# EAGLE design dual power supply (EAGLE 9.6.2)
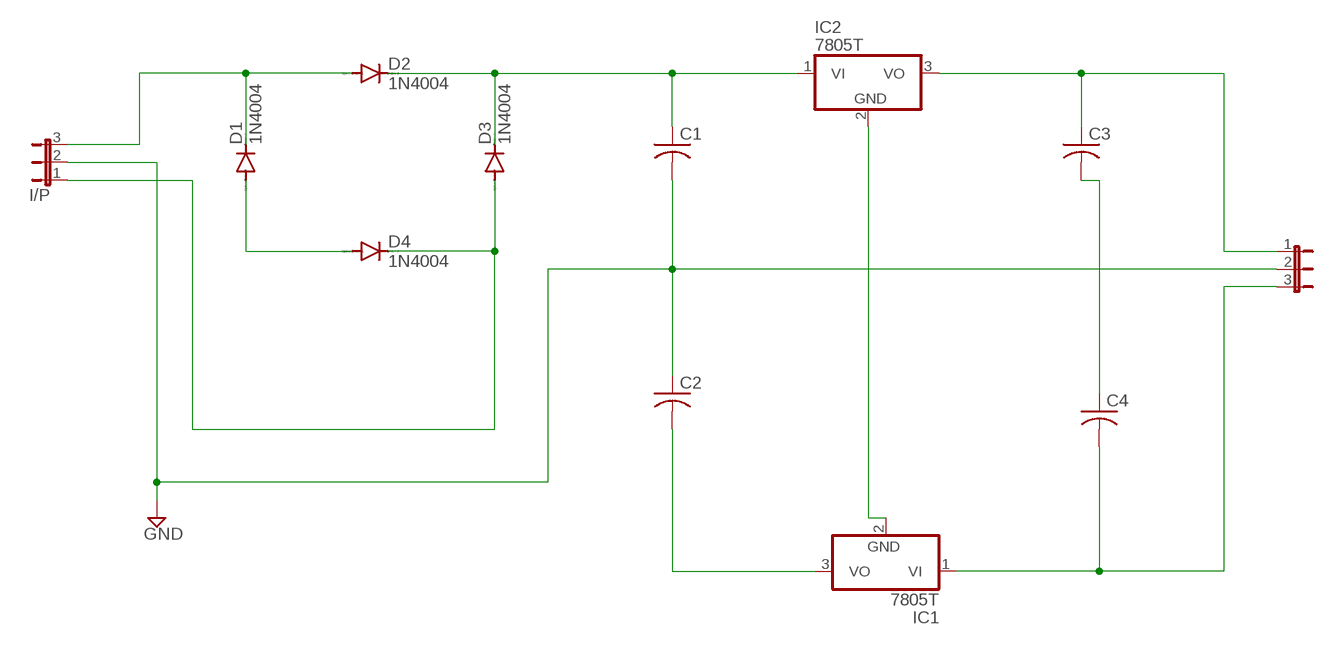
[diagram p0: schematic, sheet 1]

## Parts
C1  C-US025-024X044  [C025-024X044]
C2  C-US025-024X044  [C025-024X044]
C3  C-US025-024X044  [C025-024X044]
C4  C-US025-024X044  [C025-024X044]
D1  1N4004  [DO41-10]
D2  1N4004  [DO41-10]
D3  1N4004  [DO41-10]
D4  1N4004  [DO41-10]
I/P  JP2E  [JP2]
IC1  7805T  [TO220H]
IC2  7805T  [TO220H]
O/P  JP2E  [JP2]

## Nets
GND: C1.2 C2.1 I/P.2 O/P.2
N$1: D1.C D2.A I/P.3
N$2: D1.A D4.A
N$3: C1.1 D2.C D3.C IC2.1(VI)
N$4: D3.A D4.C I/P.1
N$5: IC1.2(GND) IC2.2(GND)
N$6: C4.2 IC1.1(VI) O/P.3
N$8: C2.2 IC1.3(VO)
N$9: C3.1 IC2.3(VO) O/P.1
N$10: C3.2 C4.1

## Library data of the parts
C1-C4 = rcl:C-US: CAPACITOR, American symbol; SPICEPREFIX: C
D1-D4 = diode:1N4004: DIODE general purpose rectifier, 1 A
I/P O/P = jumper:JP2E: JUMPER
IC1 IC2 = linear:78*: Positive VOLTAGE REGULATOR Source: http://cache.national.com/ds/LM/LM78L05.pdf http://www.fairchildsemi.com/ds/LM/LM7805.pdf

## Board
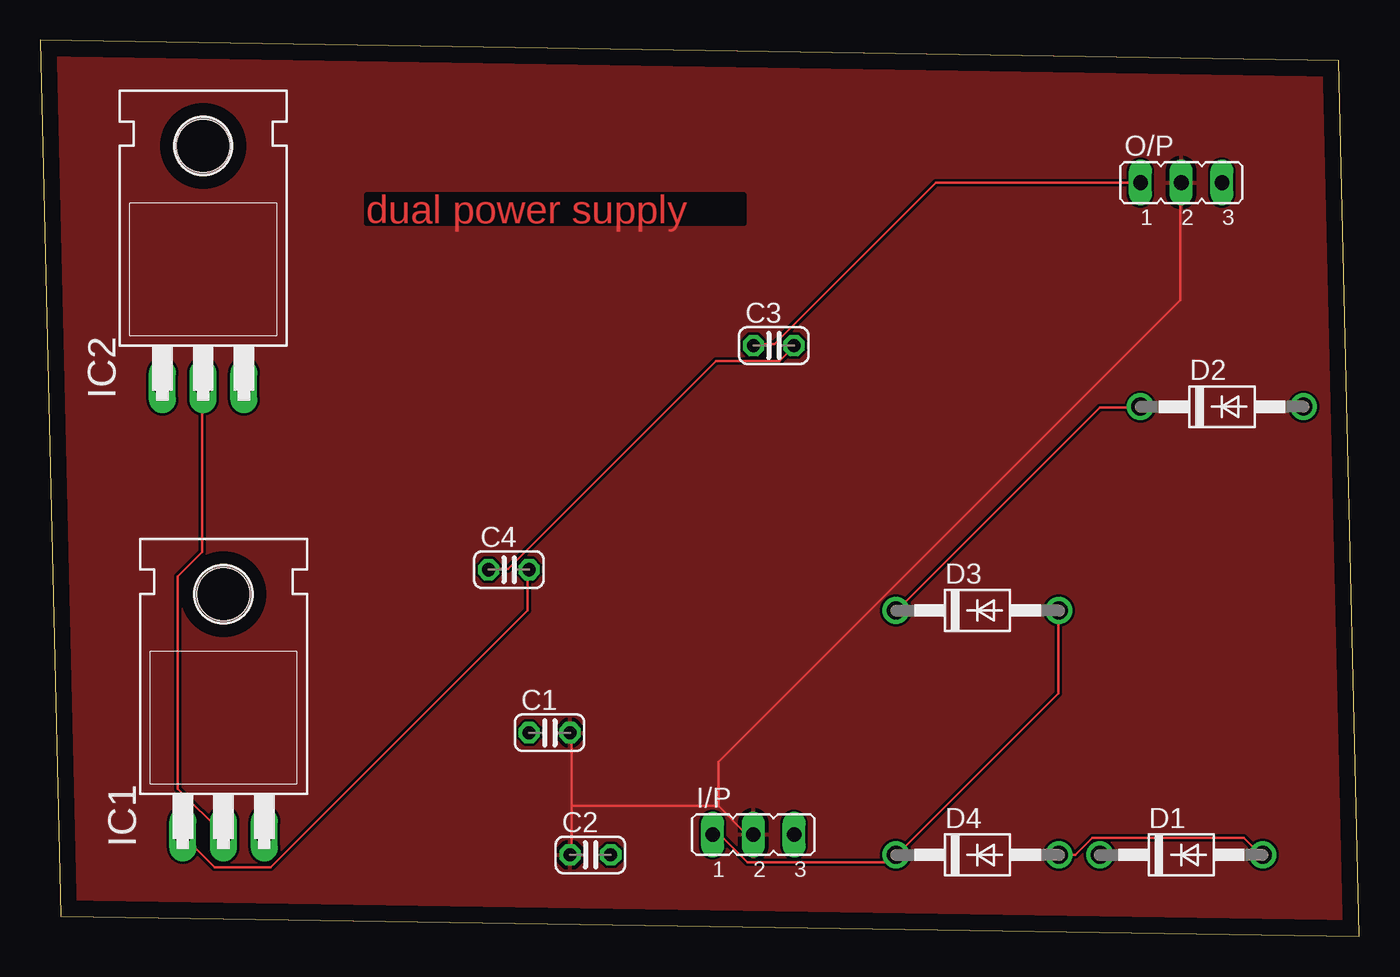
[diagram p1: board, top side]
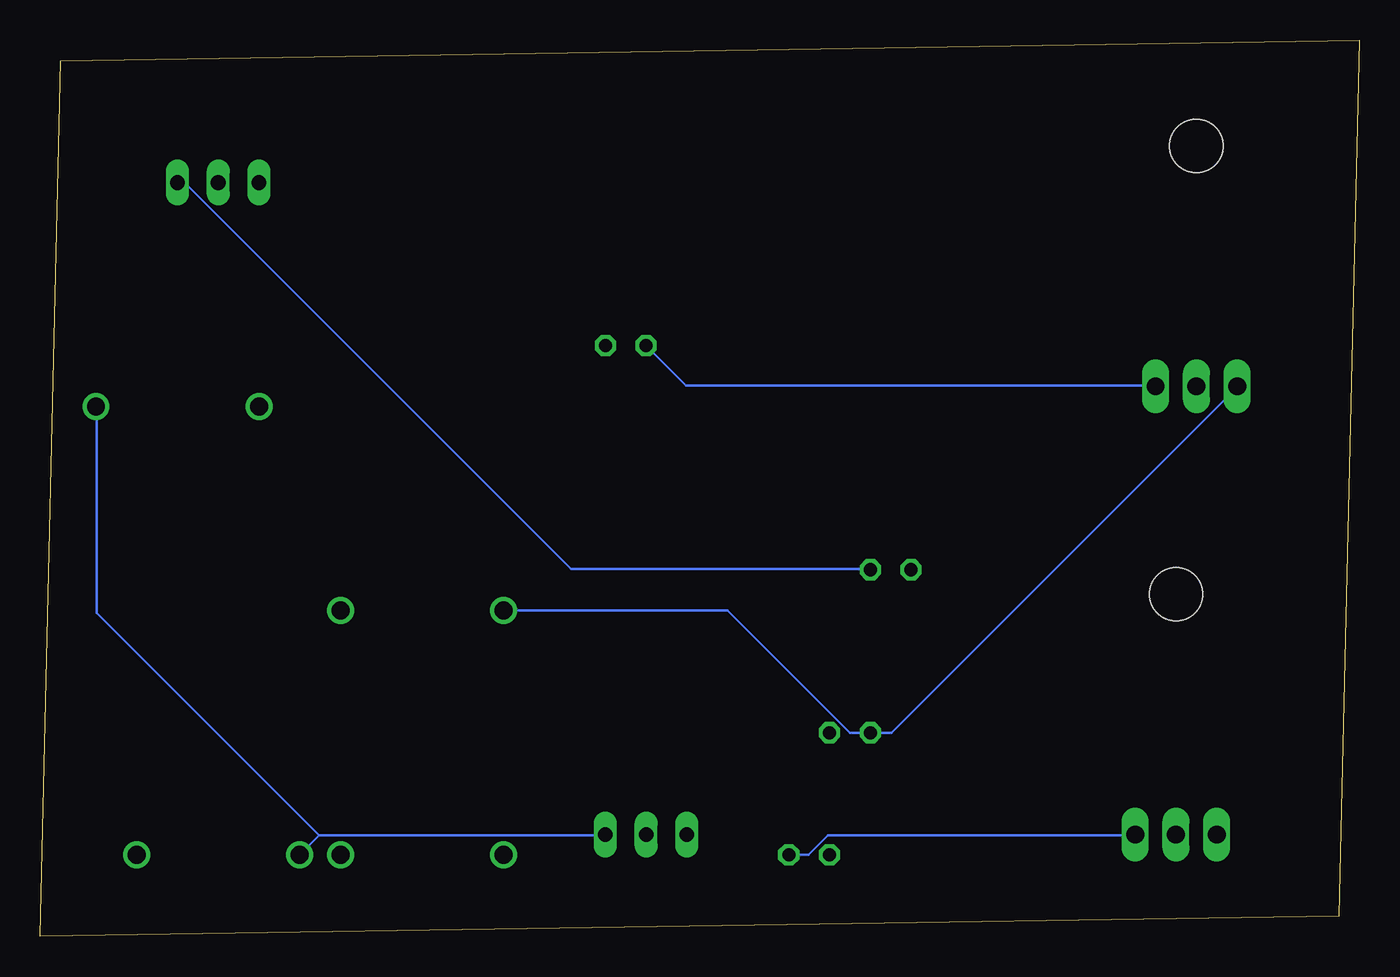
[diagram p2: board, bottom side, seen from below]

Size 82.22 x 55.87 mm. Coordinates in mm from the lower left corner, seen from the top.
Outline: 1.27,1.27 82.22,0 80.95,54.6 0,55.87 1.27,1.27
Copper layers (1*16): Top 0.035mm / dielectric 1.5mm / Bottom 0.035mm
Design rules "default": minimum track width 6mil, minimum drill 0.35mm, track to track 6mil, track to pad 6mil, pad to pad 6mil, via to via 6mil, smd to smd 6mil, copper to edge 40mil, drill to drill 6mil, minimum pad ring 10mil, minimum via ring 8mil, stop-mask expansion 4mil, vias tented up to drill 0mil, thermal gap 10mil

### Footprints (pad centres in the part's own frame; a part is rotated, then mirrored left to right if it is on the bottom)
C025-024X044 = drill 0.813 octagon: 1 -1.27,0; 2 1.27,0
DO41-10 = drill 1.118: A 5.08,0; C -5.08,0
JP2 = drill 0.914 long: 1 -2.54,0; 2 0,0; 3 2.54,0
TO220H = drill 1.118 long: 1 -2.54,-10.16; 2 0,-10.16; 3 2.54,-10.16 | hole 3.302: 0,4.826

### Placement (x,y rotation side)
C1  31.75,12.7 0 top
C2  34.29,5.08 0 top
C3  45.72,36.83 0 top
C4  29.21,22.86 0 top
D1  71.12,5.08 0 top
D2  73.66,33.02 0 top
D3  58.42,20.32 0 top
D4  58.42,5.08 0 top
I/P  44.45,6.35 0 top
IC1  11.43,16.51 0 top
IC2  10.16,44.45 0 top
O/P  71.12,46.99 0 top

### Tracks (layer width: path | path; a pad name or v marks a point on that pad's centre or on a via)
GND
  Top 0.152: 33.12,8.13 33.12,12.7 C1.2 | 33.12,8.13 33.12,5.08 C2.1 | 42.27,8.13 43.94,6.45 44.4,6.45 I/P.2 | 33.12,8.13 42.27,8.13 | 42.27,8.13 42.27,10.87 71.07,39.67 71.07,46.99 O/P.2
  pour Top: -5.08,59.69 86.36,59.69 87.63,58.42 87.63,-2.54 -2.54,-2.54 -5.08,0
N$1
  Bottom 0.152: 64.82,6.3 46.99,6.3 I/P.3 | D1.C 64.82,6.3 | 64.82,6.3 78.69,20.17 78.69,32.97 D2.A
N$2
  Top 0.152: D4.A 64.52,5.08 65.58,6.15 75.03,6.15 76.1,5.08 D1.A
N$3
  Top 0.152: D2.C 68.48,32.97 66.04,32.97 53.39,20.32 D3.C
  Bottom 0.152: D3.C 39.37,20.32 31.75,12.7 C1.1 29.16,12.7 7.67,34.19 IC2.1
N$4
  Top 0.152: I/P.1 41.96,6.3 42.42,6.3 44.09,4.62 52.78,4.62 53.24,5.08 D4.C 53.39,5.08 63.45,15.14 63.45,20.32 D3.A
N$5
  Top 0.152: IC1.2 8.59,9.2 8.59,22.45 10.11,23.98 10.11,34.19 IC2.2
N$6
  Top 0.152: C4.2 30.38,22.76 30.38,20.32 14.38,4.32 10.87,4.32 8.89,6.3 IC1.1
  Bottom 0.152: O/P.3 73.2,46.99 49.12,22.91 30.53,22.91 C4.2
N$8
  Bottom 0.152: C2.2 34.34,5.08 33.12,6.3 14.07,6.3 IC1.3
N$9
  Top 0.152: O/P.1 55.83,46.99 45.77,36.93 44.55,36.93 C3.1
  Bottom 0.152: C3.1 41.96,34.34 12.7,34.34 IC2.3
N$10
  Top 0.152: C4.1 27.94,22.91 29.16,22.91 42.11,35.87 46.08,35.87 46.99,36.78 C3.2

### Text on the board
Top: dual power supply